# Altium project HardwareWatchdog.PrjPcb
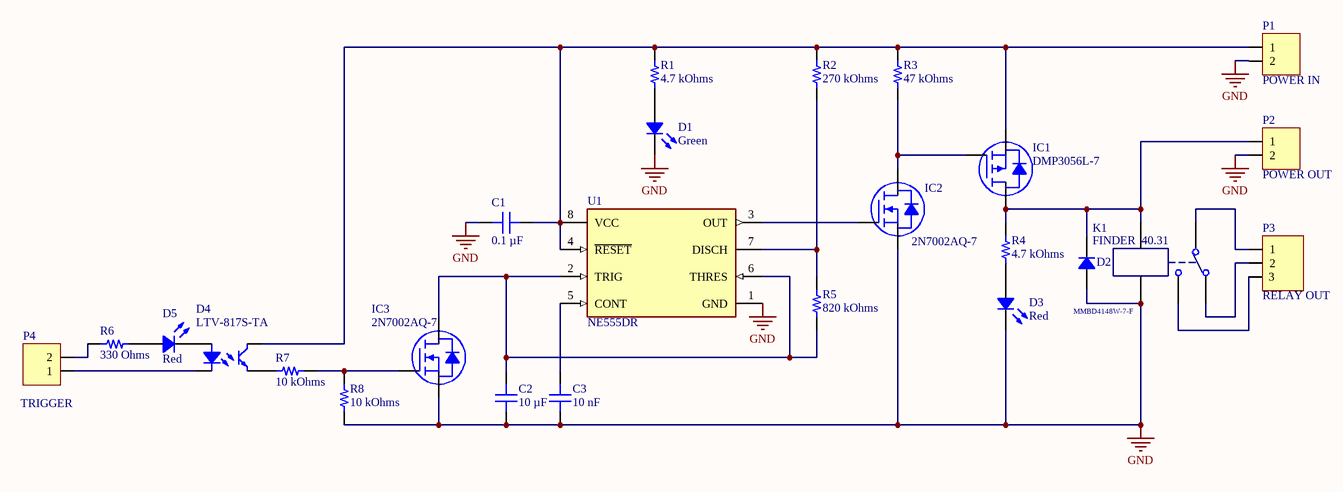
[diagram p0: DE-130624.SchDoc]
1 sheet, 25 parts. Net scope: global (net labels, ports and power ports of the same name join across sheets).
Board file: DE-130624.PcbDoc

## Sheet DE-130624.SchDoc
size A4; SheetNumber: 1; SheetTotal: 1

### Parts
C1  0.1 µF  [CAP 0603_1608]
C2  10 µF  [CAP 0805_2012]
C3  10 nF  [CAP 0603_1608]
D1  Green  [1.6X0.8X0.8]
D2  MMBD4148W-7-F  [DIODES SOT-323-3]
D3  Red  [1.6X0.8X0.8]
D4  LTV-817S-TA  [LITEON LTV-817]
D5  Red  [1.6X0.8X0.8]
IC1  DMP3056L-7  [DIODES SOT-23-3]
IC2  2N7002AQ-7  [DIODES SOT-23-3]
IC3  2N7002AQ-7  [DIODES SOT-23-3]
K1  FINDER  40.31  [FINDER 40.31]
P1  POWER IN  [TERMINAL BLOK 2]
P2  POWER OUT  [TERMINAL BLOK 2]
P3  RELAY OUT  [TERMINAL BLOK 3]
P4  TRIGGER  [TERMINAL BLOK 2]
R1  4.7 kOhms  [RES 0805_2012]
R2  270 kOhms  [RES 0805_2012]
R3  47 kOhms  [RES 0805_2012]
R4  4.7 kOhms  [RES 0805_2012]
R5  820 kOhms  [RES 0805_2012]
R6  330 Ohms  [RES 0805_2012]
R7  10 kOhms  [RES 0805_2012]
R8  10 kOhms  [RES 0805_2012]
U1  NE555DR  [FP-D0008A-IPC_B]

### Nets
GND: C1.1 C2.1 C3.1 D1.2 D2.1 D3.2 IC2.2(S) IC3.2(S) K1.2 P1.2 P2.2 R8.1 U1.1(GND)
NetC1_2: C1.2 D4.4 IC1.2(S) P1.1 R1.2 R2.2 R3.2 U1.4(~{RESET}) U1.8(VCC)
NetC2_2: C2.2 IC3.3(D) R5.1 U1.2(TRIG) U1.6(THRES)
NetC3_2: C3.2 U1.5(CONT)
NetD1_1: D1.1 R1.1
NetD2_2: D2.2 IC1.3(D) K1.1 P2.1 R4.2
NetD3_1: D3.1 R4.1
NetD4_1: D4.1 D5.2
NetD4_2: D4.2 P4.1
NetD4_3: D4.3 R7.2
NetD5_1: D5.1 R6.2
NetIC1_1: IC1.1(G) IC2.3(D) R3.1
NetIC2_1: IC2.1(G) U1.3(OUT)
NetIC3_1: IC3.1(G) R7.1 R8.2
NetK1_3: K1.3 P3.1
NetK1_4: K1.4 P3.3
NetK1_5: K1.5 P3.2
NetP4_2: P4.2 R6.1
NetR2_1: R2.1 R5.2 U1.7(DISCH)

### Library data of the parts
C1 = C0603C104K5RAC7411: CAP CER 0.1UF 50V X7R 0603; manufacturer: KEMET; Tolerance: ±10%; Part Number: C0603C104K5RAC7411; Value: 0.1 µF; Applications: Bypass, Decoupling; Capacitance: 0.1 µF; componentlink1description: Datasheet; componentlink1url: https://api.kemet.com/component-edge/download/datasheet/C0603C104K5RAC7411.pdf; componentlink2description: DigiKey Link; componentlink2url: https://www.digikey.com/en/products/detail/kemet/C0603C104K5RAC7411/3317013; Device Package: 0603 (1608 Metric); lastupdated: 9. 2. 2024. 20:10:30; Lifecycle Status: Active; Minimum Order: 1; Mounting Type: Surface Mount, MLCC; Operating Temperature: -55°C ~ 125°C; Package / Case: 0603 (1608 Metric); packaging: TapeAndReel; partid: 2233; Part Status: Active; price: 0.01; series: SMD Comm X7R; Size / Dimension: 0.063" L x 0.031" W (1.60mm x 0.80mm); Supplier 1: DigiKey; Supplier Part Number 1: 399-C0603C104K5RAC7411CT-ND; Temperature Coefficient: X7R; Thickness (Max): 0.035" (0.90mm); Voltage - Rated: 50V
C2 = GMK212BBJ106KG-T: CAP CER 10UF 35V X5R 0805; manufacturer: Taiyo Yuden; Tolerance: ±10%; Part Number: GMK212BBJ106KG-T; Value: 10 µF; Applications: SMPS Filtering; Capacitance: 10 µF; componentlink1description: Datasheet; componentlink1url: http://www.yuden.co.jp/productdata/catalog/mlcc06_e.pdf; componentlink2description: DigiKey Link; componentlink2url: https://www.digikey.com/en/products/detail/taiyo-yuden/GMK212BBJ106KG-T/6563486; Device Package: 0805 (2012 Metric); lastupdated: 9. 2. 2024. 20:15:45; Lifecycle Status: Active; Minimum Order: 1; Mounting Type: Surface Mount, MLCC; Operating Temperature: -55°C ~ 85°C; Package / Case: 0805 (2012 Metric); packaging: TapeAndReel; partid: 11657; Part Status: Active; price: 0.15; series: M; Size / Dimension: 0.079" L x 0.049" W (2.00mm x 1.25mm); Supplier 1: DigiKey; Supplier Part Number 1: 587-4893-1-ND; Temperature Coefficient: X5R; Thickness (Max): 0.057" (1.45mm); Voltage - Rated: 35V
C3 = C0603X103K1RAC3316: CAP CER 0603 10NF 100V X7R; manufacturer: KEMET; Capacitance: 10000 pF; Tolerance: ±10%; Part Number: C0603X103K1RAC3316; Value: 10 nF; Applications: Automotive, Boardflex Sensitive; componentlink1description: Datasheet; componentlink1url: https://api.kemet.com/component-edge/download/datasheet/C0603X103K1RAC3316.pdf; componentlink2description: DigiKey Link; componentlink2url: https://www.digikey.com/en/products/detail/kemet/C0603X103K1RAC3316/10315782; Device Package: 0603 (1608 Metric); Features: Soft Termination; lastupdated: 9. 2. 2024. 20:10:22; Lifecycle Status: Active; Minimum Order: 1; Mounting Type: Surface Mount, MLCC; Operating Temperature: -55°C ~ 125°C; Package / Case: 0603 (1608 Metric); packaging: TapeAndReel; partid: 8591; Part Status: Active; price: 0.07; Ratings: AEC-Q200; series: SMD Auto X7R VW80808; Size / Dimension: 0.063" L x 0.031" W (1.60mm x 0.80mm); Supplier 1: DigiKey; Supplier Part Number 1: 399-C0603X103K1RAC3316CT-ND; Temperature Coefficient: X7R; Thickness (Max): 0.037" (0.95mm); Voltage - Rated: 100V
D1 = LTST-C170KGKT: LED GREEN CLEAR SMD; Manufacturer: Lite-On Inc.; Configuration: Standard; Current - Test: 20mA; Lens Color: Colorless; Lens Size: 1.40mm x 1.25mm; Lens Style: Rectangle with Flat Top; Millicandela Rating: 35mcd; Viewing Angle: 130°; Voltage - Forward (Vf) (Typ): 2V; Wavelength - Dominant: 571nm; Wavelength - Peak: 574nm; Part Number: LTST-C170KGKT; Color: Green; ComponentLink1Description: Datasheet; ComponentLink1URL: http://optoelectronics.liteon.com/upload/download/DS22-2000-073/LTST-C170KGKT.pdf; ComponentLink2Description: DigiKey Link; ComponentLink2URL: http://digikey.com/product-detail/en/lite-on-inc/LTST-C170KGKT/160-1414-1-ND/386776; Device Package: 0805 (2012 Metric); Height (Max): 1.10mm; LastUpdated: 3. 6. 2024. 20:00:29; Lens Transparency: Clear; Lifecycle Status: Active; Minimum Order: 1; Mounting Type: Surface Mount; Package / Case: 0805 (2012 Metric); Packaging: TapeAndReel; PartId: 285; Part Status: Active; Price: 0.06; Series: -; Size / Dimension: 2.00mm L x 1.25mm W; Supplier 1: DigiKey; Supplier Part Number 1: 160-1414-1-ND; Value: Green
D2 = MMBD4148W-7-F: DIODE GEN PURP 75V 150MA SOT323; Manufacturer: Diodes Incorporated; Capacitance @ Vr, F: 2pF @ 0V, 1MHz; Current - Reverse Leakage @ Vr: 1 µA @ 75 V; Diode Type: Standard; Reverse Recovery Time (trr): 4 ns; Speed: Small Signal =< 200mA (Io), Any Speed; Voltage - Forward (Vf) (Max) @ If: 1.25 V @ 150 mA; Part Number: MMBD4148W-7-F; ComponentLink1Description: Datasheet; ComponentLink1URL: https://www.diodes.com/assets/Datasheets/ds30094.pdf; ComponentLink2Description: DigiKey Link; ComponentLink2URL: https://www.digikey.com/en/products/detail/diodes-incorporated/MMBD4148W-7-F/768787; Current - Average Rectified (Io): 150mA; LastUpdated: 3. 6. 2024. 20:01:39; Lifecycle Status: Active; Minimum Order: 1; Mounting Type: Surface Mount; Operating Temperature - Junction: -65°C ~ 150°C; Package / Case: SC-70, SOT-323; Packaging: TapeAndReel; PartId: 13; Part Status: Active; Price: 0.02; Series: -; Supplier 1: DigiKey; Supplier Part Number 1: MMBD4148W-FDICT-ND; Supplier Device Package: SOT-323; Voltage - DC Reverse (Vr) (Max): 75 V
D3 D5 = LTST-C170KAKT: LED RED CLEAR SMD; Manufacturer: Lite-On Inc.; Configuration: Standard; Current - Test: 20mA; Lens Color: Colorless; Lens Size: 1.40mm x 1.25mm; Lens Style: Rectangle with Flat Top; Millicandela Rating: 54mcd; Viewing Angle: 130°; Voltage - Forward (Vf) (Typ): 2V; Wavelength - Dominant: 615nm; Wavelength - Peak: 621nm; Part Number: LTST-C170KAKT; Color: Red; ComponentLink1Description: Datasheet; ComponentLink1URL: http://optoelectronics.liteon.com/upload/download/DS-22-99-0182/LTST-C170KAKT.pdf; ComponentLink2Description: DigiKey Link; ComponentLink2URL: http://digikey.com/product-detail/en/lite-on-inc/LTST-C170KAKT/160-1412-1-ND/386772; Device Package: 0805 (2012 Metric); Height (Max): 1.10mm; LastUpdated: 3. 6. 2024. 20:00:07; Lens Transparency: Clear; Lifecycle Status: Active; Minimum Order: 1; Mounting Type: Surface Mount; Package / Case: 0805 (2012 Metric); Packaging: TapeAndReel; PartId: 305; Part Status: Active; Price: 0.07; Series: -; Size / Dimension: 2.00mm L x 1.25mm W; Supplier 1: DigiKey; Supplier Part Number 1: 160-1412-1-ND; Value: Red
D4 = LTV-817S-TA: OPTOISOLATR 5KV TRANSISTOR 4-SMD; Manufacturer: Lite-On Inc.; Current - DC Forward (If) (Max): 50mA; Current Transfer Ratio (Max): 600% @ 5mA; Current Transfer Ratio (Min): 50% @ 5mA; Input Type: DC; Number of Channels: 1; Rise / Fall Time (Typ): 4µs, 3µs; Vce Saturation (Max): 200mV; Voltage - Forward (Vf) (Typ): 1.2V; Voltage - Isolation: 5000Vrms; Voltage - Output (Max): 35V; Part Number: LTV-817S-TA; ComponentLink1Description: Datasheet; ComponentLink1URL: http://optoelectronics.liteon.com/upload/download/DS-70-96-0016/LTV-8X7%20series%20201610%20.pdf; ComponentLink2Description: DigiKey Link; ComponentLink2URL: http://digikey.com/product-detail/en/lite-on-inc/LTV-817S-TA/160-2038-1-ND/3711420; Current - Output / Channel: 50mA; Device Package: 4-SMD, Gull Wing; LastUpdated: 12. 1. 2020. 21:59:02; Lifecycle Status: Active; Minimum Order: 1; Mounting Type: Surface Mount; Operating Temperature: -30°C ~ 110°C; Output Type: Transistor; Package / Case: 4-SMD, Gull Wing; Packaging: TapeAndReel; Part Status: Active; Price: 0.12; Series: -; Supplier 1: DigiKey; Supplier Part Number 1: 160-2038-1-ND; Supplier Device Package: 4-SMD
IC1 = DMP3056L-7: MOSFET P-CH 30V 4.3A SOT23; Manufacturer: Diodes Incorporated; Current - Continuous Drain (Id) @ 25°C: 4.3A (Ta); Drive Voltage (Max Rds On,  Min Rds On): 4.5V, 10V; FET Type: P-Channel; Gate Charge (Qg) (Max) @ Vgs: 11.8 nC @ 10 V; Input Capacitance (Ciss) (Max) @ Vds: 642 pF @ 25 V; Power Dissipation (Max): 1.38W (Ta); Rds On (Max) @ Id, Vgs: 50mOhm @ 6A, 10V; Vgs (Max): ±25V; Vgs(th) (Max) @ Id: 2.1V @ 250µA; Part Number: DMP3056L-7; ComponentLink1Description: Datasheet; ComponentLink1URL: https://www.diodes.com/assets/Datasheets/DMP3056L.pdf; ComponentLink2Description: DigiKey Link; ComponentLink2URL: https://www.digikey.com/en/products/detail/diodes-incorporated/DMP3056L-7/5126843; Drain to Source Voltage (Vdss): 30 V; LastUpdated: 3. 6. 2024. 20:15:20; Lifecycle Status: Active; Minimum Order: 1; Mounting Type: Surface Mount; Operating Temperature: -55°C ~ 150°C (TJ); Package / Case: TO-236-3, SC-59, SOT-23-3; Packaging: TapeAndReel; Part Status: Active; Price: 0.09; Series: -; Supplier 1: DigiKey; Supplier Part Number 1: DMP3056L-7DICT-ND; Supplier Device Package: SOT-23-3; Technology: MOSFET (Metal Oxide)
IC2 IC3 = 2N7002AQ-7: MOSFET N-CH 60V 180MA SOT23; Manufacturer: Diodes Incorporated; Current - Continuous Drain (Id) @ 25°C: 180mA (Ta); Drive Voltage (Max Rds On,  Min Rds On): 5V; FET Type: N-Channel; Input Capacitance (Ciss) (Max) @ Vds: 23 pF @ 25 V; Power Dissipation (Max): 370mW (Ta); Rds On (Max) @ Id, Vgs: 5Ohm @ 115mA, 10V; Vgs (Max): ±20V; Vgs(th) (Max) @ Id: 2V @ 250µA; Part Number: 2N7002AQ-7; ComponentLink1Description: Datasheet; ComponentLink1URL: https://www.diodes.com/assets/Datasheets/2N7002AQ.pdf; ComponentLink2Description: DigiKey Link; ComponentLink2URL: https://www.digikey.com/en/products/detail/diodes-incorporated/2N7002AQ-7/6186937; Drain to Source Voltage (Vdss): 60 V; LastUpdated: 3. 6. 2024. 20:15:18; Lifecycle Status: Active; Minimum Order: 1; Mounting Type: Surface Mount; Operating Temperature: -55°C ~ 150°C (TJ); Package / Case: TO-236-3, SC-59, SOT-23-3; Packaging: TapeAndReel; Part Status: Active; Price: 0.03; Series: -; Supplier 1: DigiKey; Supplier Part Number 1: 2N7002AQ-7DICT-ND; Supplier Device Package: SOT-23-3; Technology: MOSFET (Metal Oxide)
K1 = FINDER RELAY 40.31
P1 P2 P4 = TERMINAL BLOK 2: Terminal blok konektor 3,5 mm
P3 = TERMINAL BLOK 3: 3 pinski terminal blok konektor
R1 R4 = AC0805FR-7W4K7L: RES 4.7K OHM 1% 1/4W 0805; Manufacturer: Yageo; Power (Watts): 0.25W, 1/4W; Temperature Coefficient: ±100ppm/°C; Part Number: AC0805FR-7W4K7L; Value: 4.7 kOhms; ComponentLink1Description: Datasheet; ComponentLink1URL: https://www.yageo.com/upload/media/product/productsearch/datasheet/rchip/PYu-AC_51_RoHS_L_9.pdf; ComponentLink2Description: DigiKey Link; ComponentLink2URL: https://www.digikey.com/en/products/detail/yageo/AC0805FR-7W4K7L/16989051; Composition: Thick Film; Device Package: 0805 (2012 Metric); Features: Automotive AEC-Q200, Moisture Resistant; Height - Seated (Max): 0.024" (0.60mm); LastUpdated: 8. 2. 2024. 21:00:02; Lifecycle Status: Active; Minimum Order: 1; Number of Terminations: 2; Operating Temperature: -55°C ~ 155°C; Package / Case: 0805 (2012 Metric); Packaging: TapeAndReel; PartId: 77750; Part Status: Active; Price: 0.01; Ratings: AEC-Q200; Resistance: 4.7 kOhms; Series: AC; Size / Dimension: 0.079" L x 0.049" W (2.00mm x 1.25mm); Supplier 1: DigiKey; Supplier Part Number 1: 13-AC0805FR-7W4K7LCT-ND; Supplier Device Package: 0805; Tolerance: ±1%
R2 = AC0805FR-07270KL: RES SMD 270K OHM 1% 1/8W 0805; Manufacturer: Yageo; Power (Watts): 0.125W, 1/8W; Temperature Coefficient: ±100ppm/°C; Part Number: AC0805FR-07270KL; Value: 270 kOhms; ComponentLink1Description: Datasheet; ComponentLink1URL: https://www.yageo.com/upload/media/product/productsearch/datasheet/rchip/PYu-AC_51_RoHS_L_8.pdf; ComponentLink2Description: DigiKey Link; ComponentLink2URL: https://www.digikey.com/en/products/detail/yageo/AC0805FR-07270KL/5896709; Composition: Thick Film; Device Package: 0805 (2012 Metric); Features: Automotive AEC-Q200, Moisture Resistant; Height - Seated (Max): 0.024" (0.60mm); LastUpdated: 8. 2. 2024. 21:00:40; Lifecycle Status: Active; Minimum Order: 1; Number of Terminations: 2; Operating Temperature: -55°C ~ 155°C; Package / Case: 0805 (2012 Metric); Packaging: TapeAndReel; PartId: 61828; Part Status: Active; Price: 0.01; Ratings: AEC-Q200; Resistance: 270 kOhms; Series: AC; Size / Dimension: 0.079" L x 0.049" W (2.00mm x 1.25mm); Supplier 1: DigiKey; Supplier Part Number 1: 13-AC0805FR-07270KLCT-ND; Supplier Device Package: 0805; Tolerance: ±1%
R3 = AC0805FR-0747KL: RES SMD 47K OHM 1% 1/8W 0805; Manufacturer: Yageo; Power (Watts): 0.125W, 1/8W; Temperature Coefficient: ±100ppm/°C; Part Number: AC0805FR-0747KL; Value: 47 kOhms; ComponentLink1Description: Datasheet; ComponentLink1URL: https://www.yageo.com/upload/media/product/productsearch/datasheet/rchip/PYu-AC_51_RoHS_L_7.pdf; ComponentLink2Description: DigiKey Link; ComponentLink2URL: https://www.digikey.com/en/products/detail/yageo/AC0805FR-0747KL/5896858; Composition: Thick Film; Device Package: 0805 (2012 Metric); Features: Automotive AEC-Q200, Moisture Resistant; Height - Seated (Max): 0.024" (0.60mm); LastUpdated: 8. 2. 2024. 21:02:08; Lifecycle Status: Active; Minimum Order: 1; Number of Terminations: 2; Operating Temperature: -55°C ~ 155°C; Package / Case: 0805 (2012 Metric); Packaging: TapeAndReel; PartId: 34676; Part Status: Active; Price: 0.01; Ratings: AEC-Q200; Resistance: 47 kOhms; Series: AC; Size / Dimension: 0.079" L x 0.049" W (2.00mm x 1.25mm); Supplier 1: DigiKey; Supplier Part Number 1: YAG3735CT-ND; Supplier Device Package: 0805; Tolerance: ±1%
R5 = AC0805FR-07820KL: RES SMD 820K OHM 1% 1/8W 0805; Manufacturer: Yageo; Power (Watts): 0.125W, 1/8W; Temperature Coefficient: ±100ppm/°C; Part Number: AC0805FR-07820KL; Value: 820 kOhms; ComponentLink1Description: Datasheet; ComponentLink1URL: https://www.yageo.com/upload/media/product/productsearch/datasheet/rchip/PYu-AC_51_RoHS_L_7.pdf; ComponentLink2Description: DigiKey Link; ComponentLink2URL: https://www.digikey.com/en/products/detail/yageo/AC0805FR-07820KL/5896994; Composition: Thick Film; Device Package: 0805 (2012 Metric); Features: Automotive AEC-Q200, Moisture Resistant; Height - Seated (Max): 0.024" (0.60mm); LastUpdated: 8. 2. 2024. 21:00:48; Lifecycle Status: Active; Minimum Order: 1; Number of Terminations: 2; Operating Temperature: -55°C ~ 155°C; Package / Case: 0805 (2012 Metric); Packaging: TapeAndReel; PartId: 49554; Part Status: Active; Price: 0.01; Ratings: AEC-Q200; Resistance: 820 kOhms; Series: AC; Size / Dimension: 0.079" L x 0.049" W (2.00mm x 1.25mm); Supplier 1: DigiKey; Supplier Part Number 1: YAG5381CT-ND; Supplier Device Package: 0805; Tolerance: ±1%
R6 = AT0805FRE071KL: RES 1K OHM 1% 1/8W 0805; Manufacturer: Yageo; Power (Watts): 0.125W, 1/8W; Resistance: 1 kOhms; Temperature Coefficient: ±50ppm/°C; Part Number: AT0805FRE071KL; Value: 330 Ohms; ComponentLink1Description: Datasheet; ComponentLink1URL: https://www.yageo.com/upload/media/product/productsearch/datasheet/rchip/PYu-AT_51_RoHS_L_6.pdf; ComponentLink2Description: DigiKey Link; ComponentLink2URL: https://www.digikey.com/en/products/detail/yageo/AT0805FRE071KL/16991952; Composition: Thin Film; Device Package: 0805 (2012 Metric); Features: Anti-Sulfur, Automotive AEC-Q200, Moisture Resistant; Height - Seated (Max): 0.024" (0.60mm); LastUpdated: 8. 2. 2024. 20:59:53; Lifecycle Status: Active; Minimum Order: 1; Number of Terminations: 2; Operating Temperature: -55°C ~ 155°C; Package / Case: 0805 (2012 Metric); Packaging: TapeAndReel; PartId: 81015; Price: 0.09; Ratings: AEC-Q200; Series: AT; Size / Dimension: 0.079" L x 0.049" W (2.00mm x 1.25mm); Supplier 1: DigiKey; Supplier Part Number 1: 13-AT0805FRE071KLCT-ND; Supplier Device Package: 0805; Tolerance: ±1%
R7 = AA0805FR-0710KL: RES SMD 10K OHM 1% 1/8W 0805; Manufacturer: Yageo; Power (Watts): 0.125W, 1/8W; Temperature Coefficient: ±150ppm/°C; Part Number: AA0805FR-0710KL; Value: 10 kOhms; ComponentLink1Description: Datasheet; ComponentLink1URL: https://www.yageo.com/upload/media/product/productsearch/datasheet/rchip/PYu-AA_51_RoHS_L_3.pdf; ComponentLink2Description: DigiKey Link; ComponentLink2URL: https://www.digikey.com/en/products/detail/yageo/AA0805FR-0710KL/5891935; Composition: Thick Film; Device Package: 0805 (2012 Metric); Features: Anti-Sulfur, Automotive AEC-Q200, Moisture Resistant; Height - Seated (Max): 0.024" (0.60mm); LastUpdated: 8. 2. 2024. 21:00:40; Lifecycle Status: Active; Minimum Order: 1; Number of Terminations: 2; Operating Temperature: -55°C ~ 155°C; Package / Case: 0805 (2012 Metric); Packaging: TapeAndReel; PartId: 61824; Part Status: Active; Price: 0.01; Ratings: AEC-Q200; Resistance: 10 kOhms; Series: AA; Size / Dimension: 0.079" L x 0.049" W (2.00mm x 1.25mm); Supplier 1: DigiKey; Supplier Part Number 1: 13-AA0805FR-0710KLCT-ND; Supplier Device Package: 0805; Tolerance: ±1%
R8 = AC0805FR-0727KL: RES SMD 27K OHM 1% 1/8W 0805; Manufacturer: Yageo; Power (Watts): 0.125W, 1/8W; Resistance: 27 kOhms; Temperature Coefficient: ±100ppm/°C; Part Number: AC0805FR-0727KL; Value: 10 kOhms; ComponentLink1Description: Datasheet; ComponentLink1URL: https://www.yageo.com/upload/media/product/productsearch/datasheet/rchip/PYu-AC_51_RoHS_L_8.pdf; ComponentLink2Description: DigiKey Link; ComponentLink2URL: https://www.digikey.com/en/products/detail/yageo/AC0805FR-0727KL/5896714; Composition: Thick Film; Device Package: 0805 (2012 Metric); Features: Automotive AEC-Q200, Moisture Resistant; Height - Seated (Max): 0.024" (0.60mm); LastUpdated: 8. 2. 2024. 21:00:29; Lifecycle Status: Active; Minimum Order: 1; Number of Terminations: 2; Operating Temperature: -55°C ~ 155°C; Package / Case: 0805 (2012 Metric); Packaging: TapeAndReel; PartId: 66664; Part Status: Active; Price: 0.01; Ratings: AEC-Q200; Series: AC; Size / Dimension: 0.079" L x 0.049" W (2.00mm x 1.25mm); Supplier 1: DigiKey; Supplier Part Number 1: 13-AC0805FR-0727KLCT-ND; Supplier Device Package: 0805; Tolerance: ±1%
U1 = CMP-1685-00007-2: IC OSC SGL TIMER 100KHZ 8-SOIC; Low Level Output Current: 200mA; Quiescent Current: 15mA; Min Supply Voltage: 4.5V; Number of Timers/Counters: 1; Max Supply Voltage: 16V; Operating Supply Current: 10mA; High Level Output Current: -200mA; Packaging: Tape and Reel; Frequency: 100kHz; Weight: 0.002561oz; REACH SVHC: No SVHC; Package Quantity: 2500; Width: 3.91mm; Max Operating Temperature: 70°C; Contact Plating: Gold; Lead Free: Lead Free; Number of Pins: 8; Min Operating Temperature: 0°C; Radiation Hardening: No; Length: 4.9mm; Case/Package: SOIC; Height: 1.58mm; Mount: Surface Mount